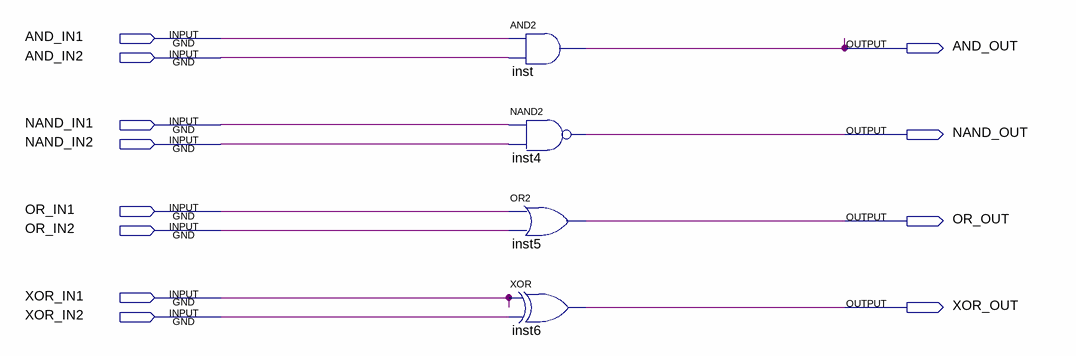
[diagram p0: schematic sheet]
// Quartus schematic schem_gates.bdf as structural Verilog: 4 symbols, 12 pins
module schem_gates (
  input  AND_IN1,
  input  AND_IN2,
  input  NAND_IN1,
  input  NAND_IN2,
  input  OR_IN1,
  input  OR_IN2,
  input  XOR_IN1,
  input  XOR_IN2,
  output AND_OUT,
  output NAND_OUT,
  output OR_OUT,
  output XOR_OUT
);

  and inst (AND_OUT, AND_IN1, AND_IN2);
  nand inst4 (NAND_OUT, NAND_IN1, NAND_IN2);
  or inst5 (OR_OUT, OR_IN1, OR_IN2);
  xor inst6 (XOR_OUT, XOR_IN1, XOR_IN2);
endmodule
